# EAGLE schematic obc (EAGLE 9.4.2), part 2 of 2
## Sheet 7 of 8: Sensors
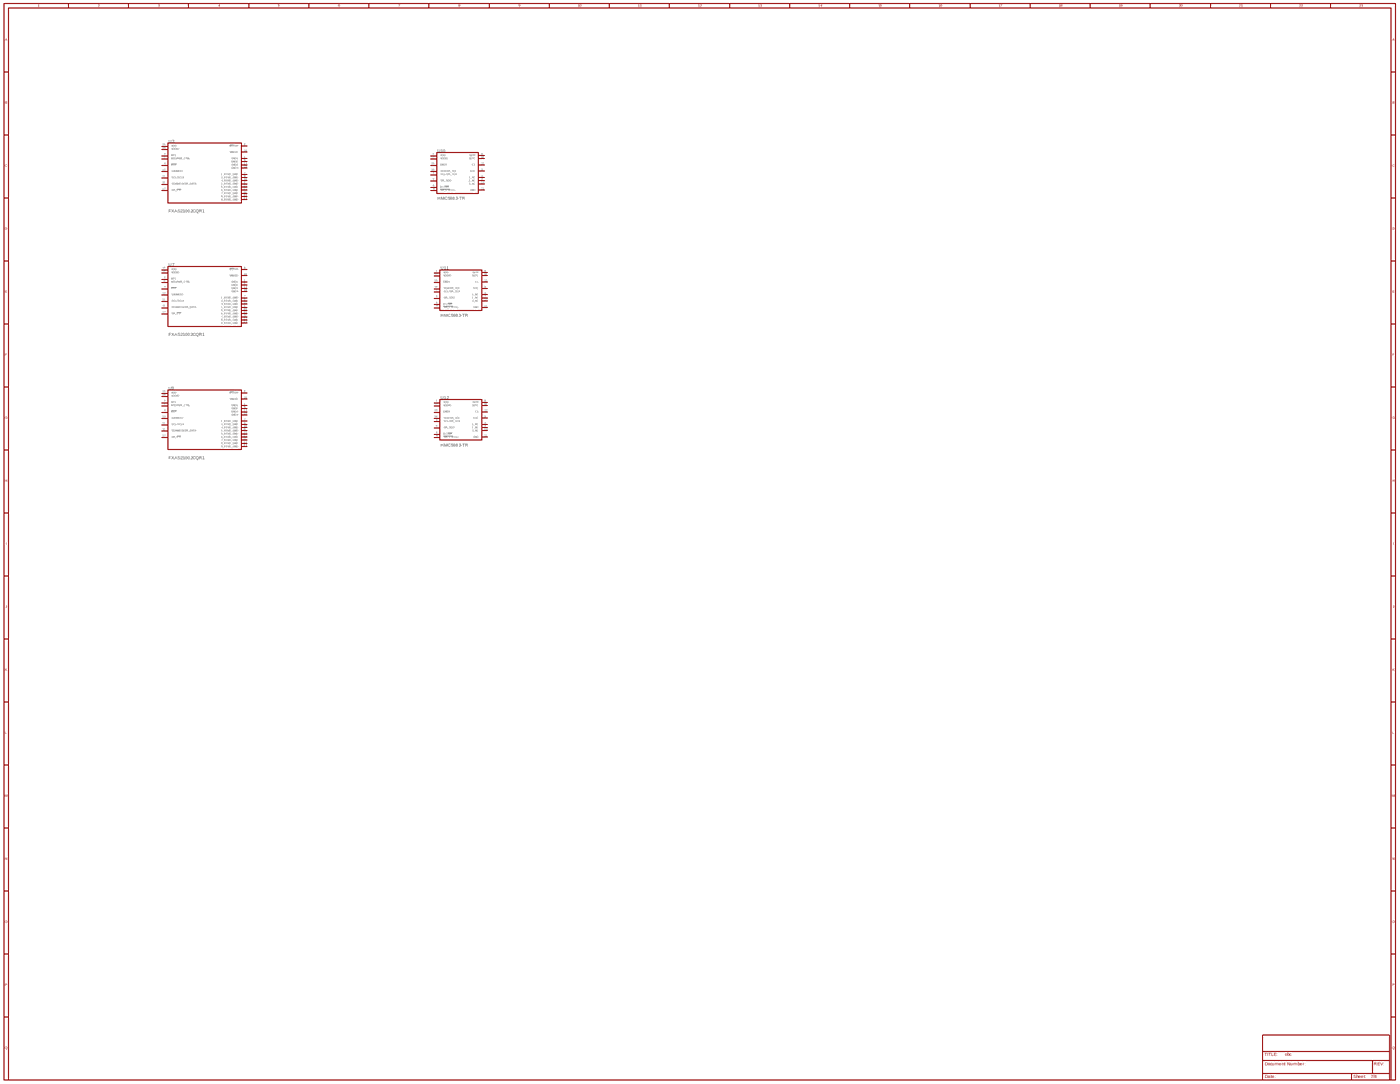
[diagram p19: schematic, sheet 7, overview]
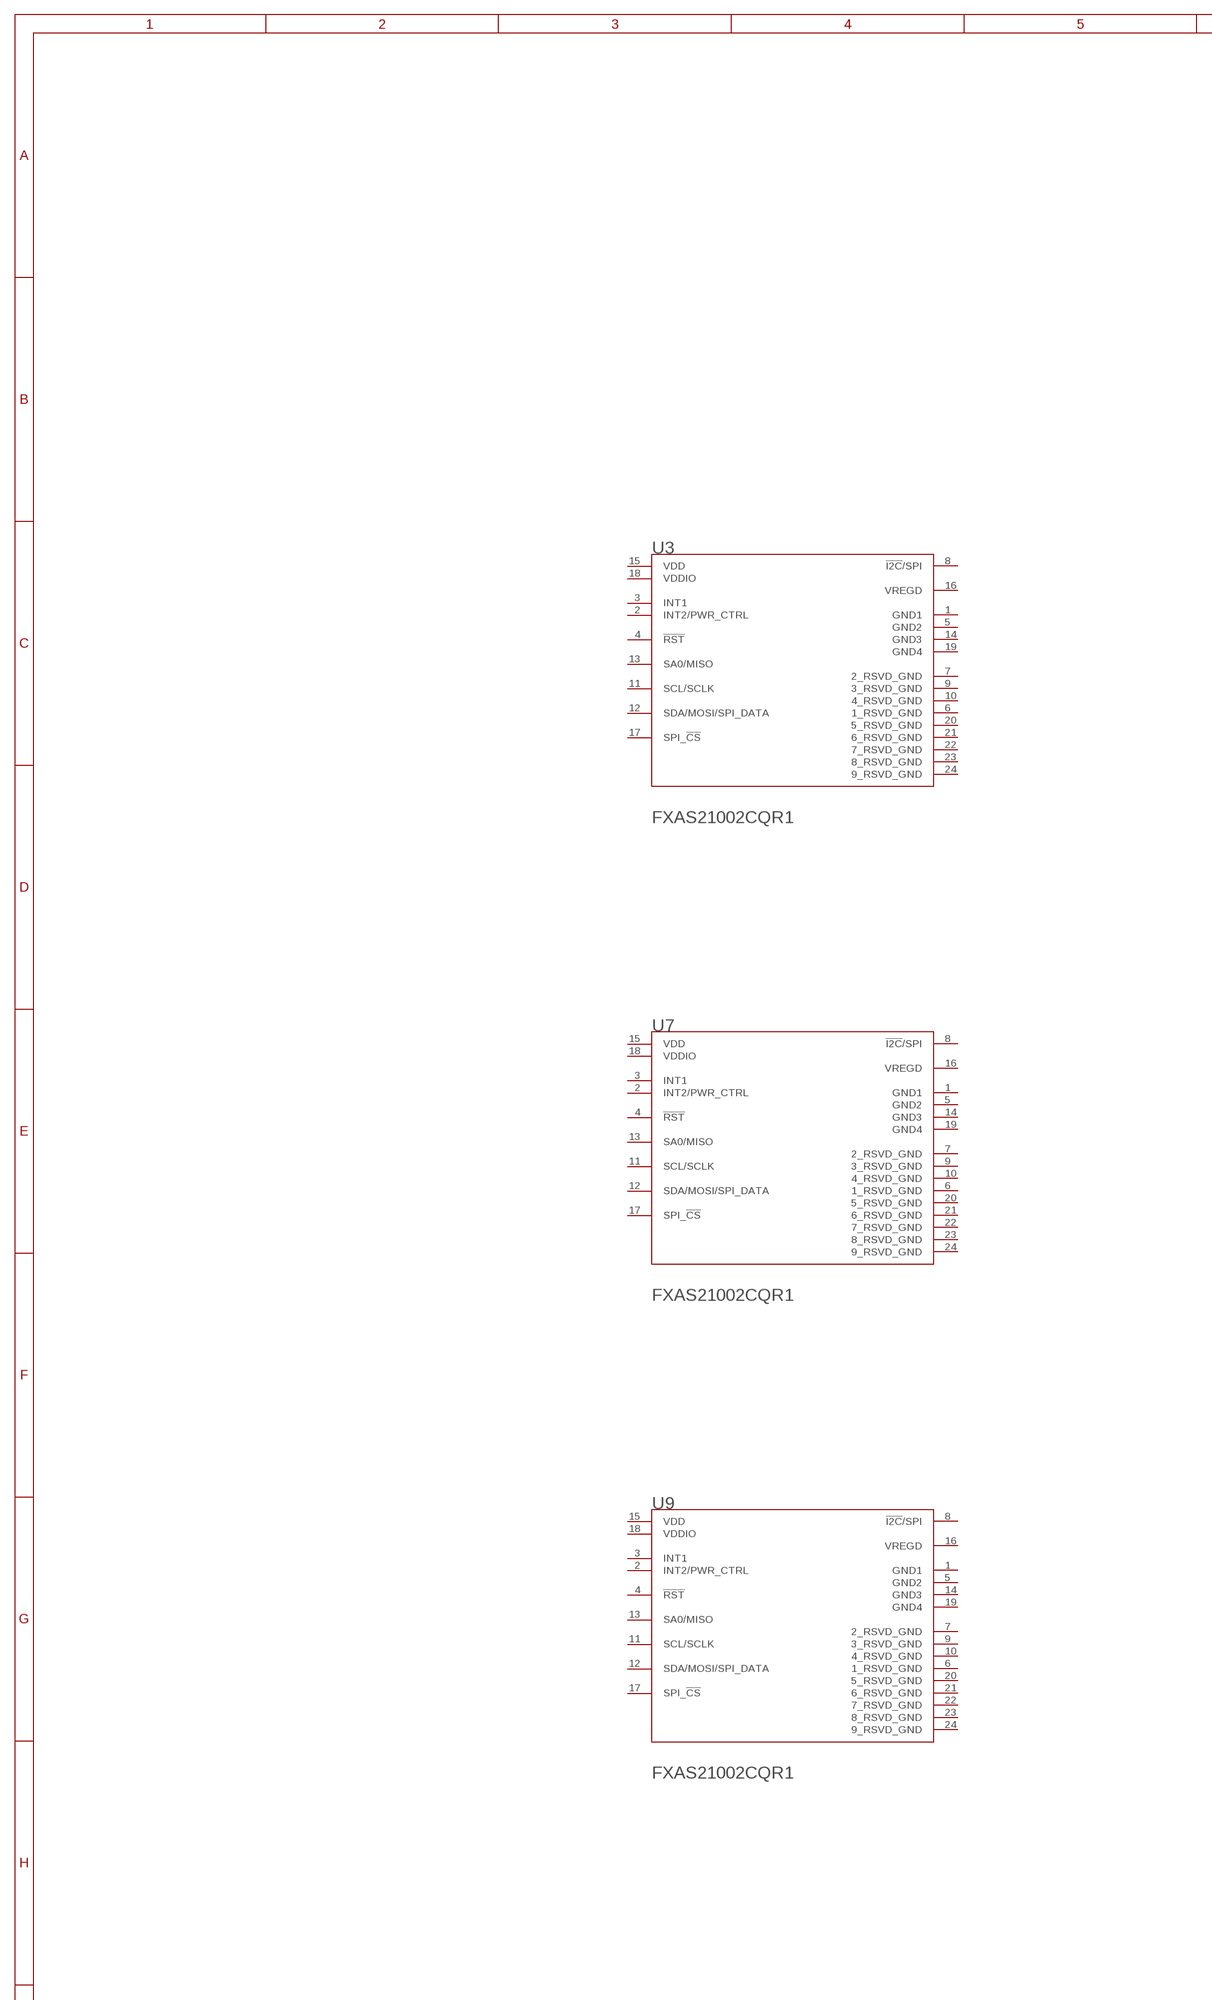
[diagram p20: schematic, sheet 7, part 1 of 6]
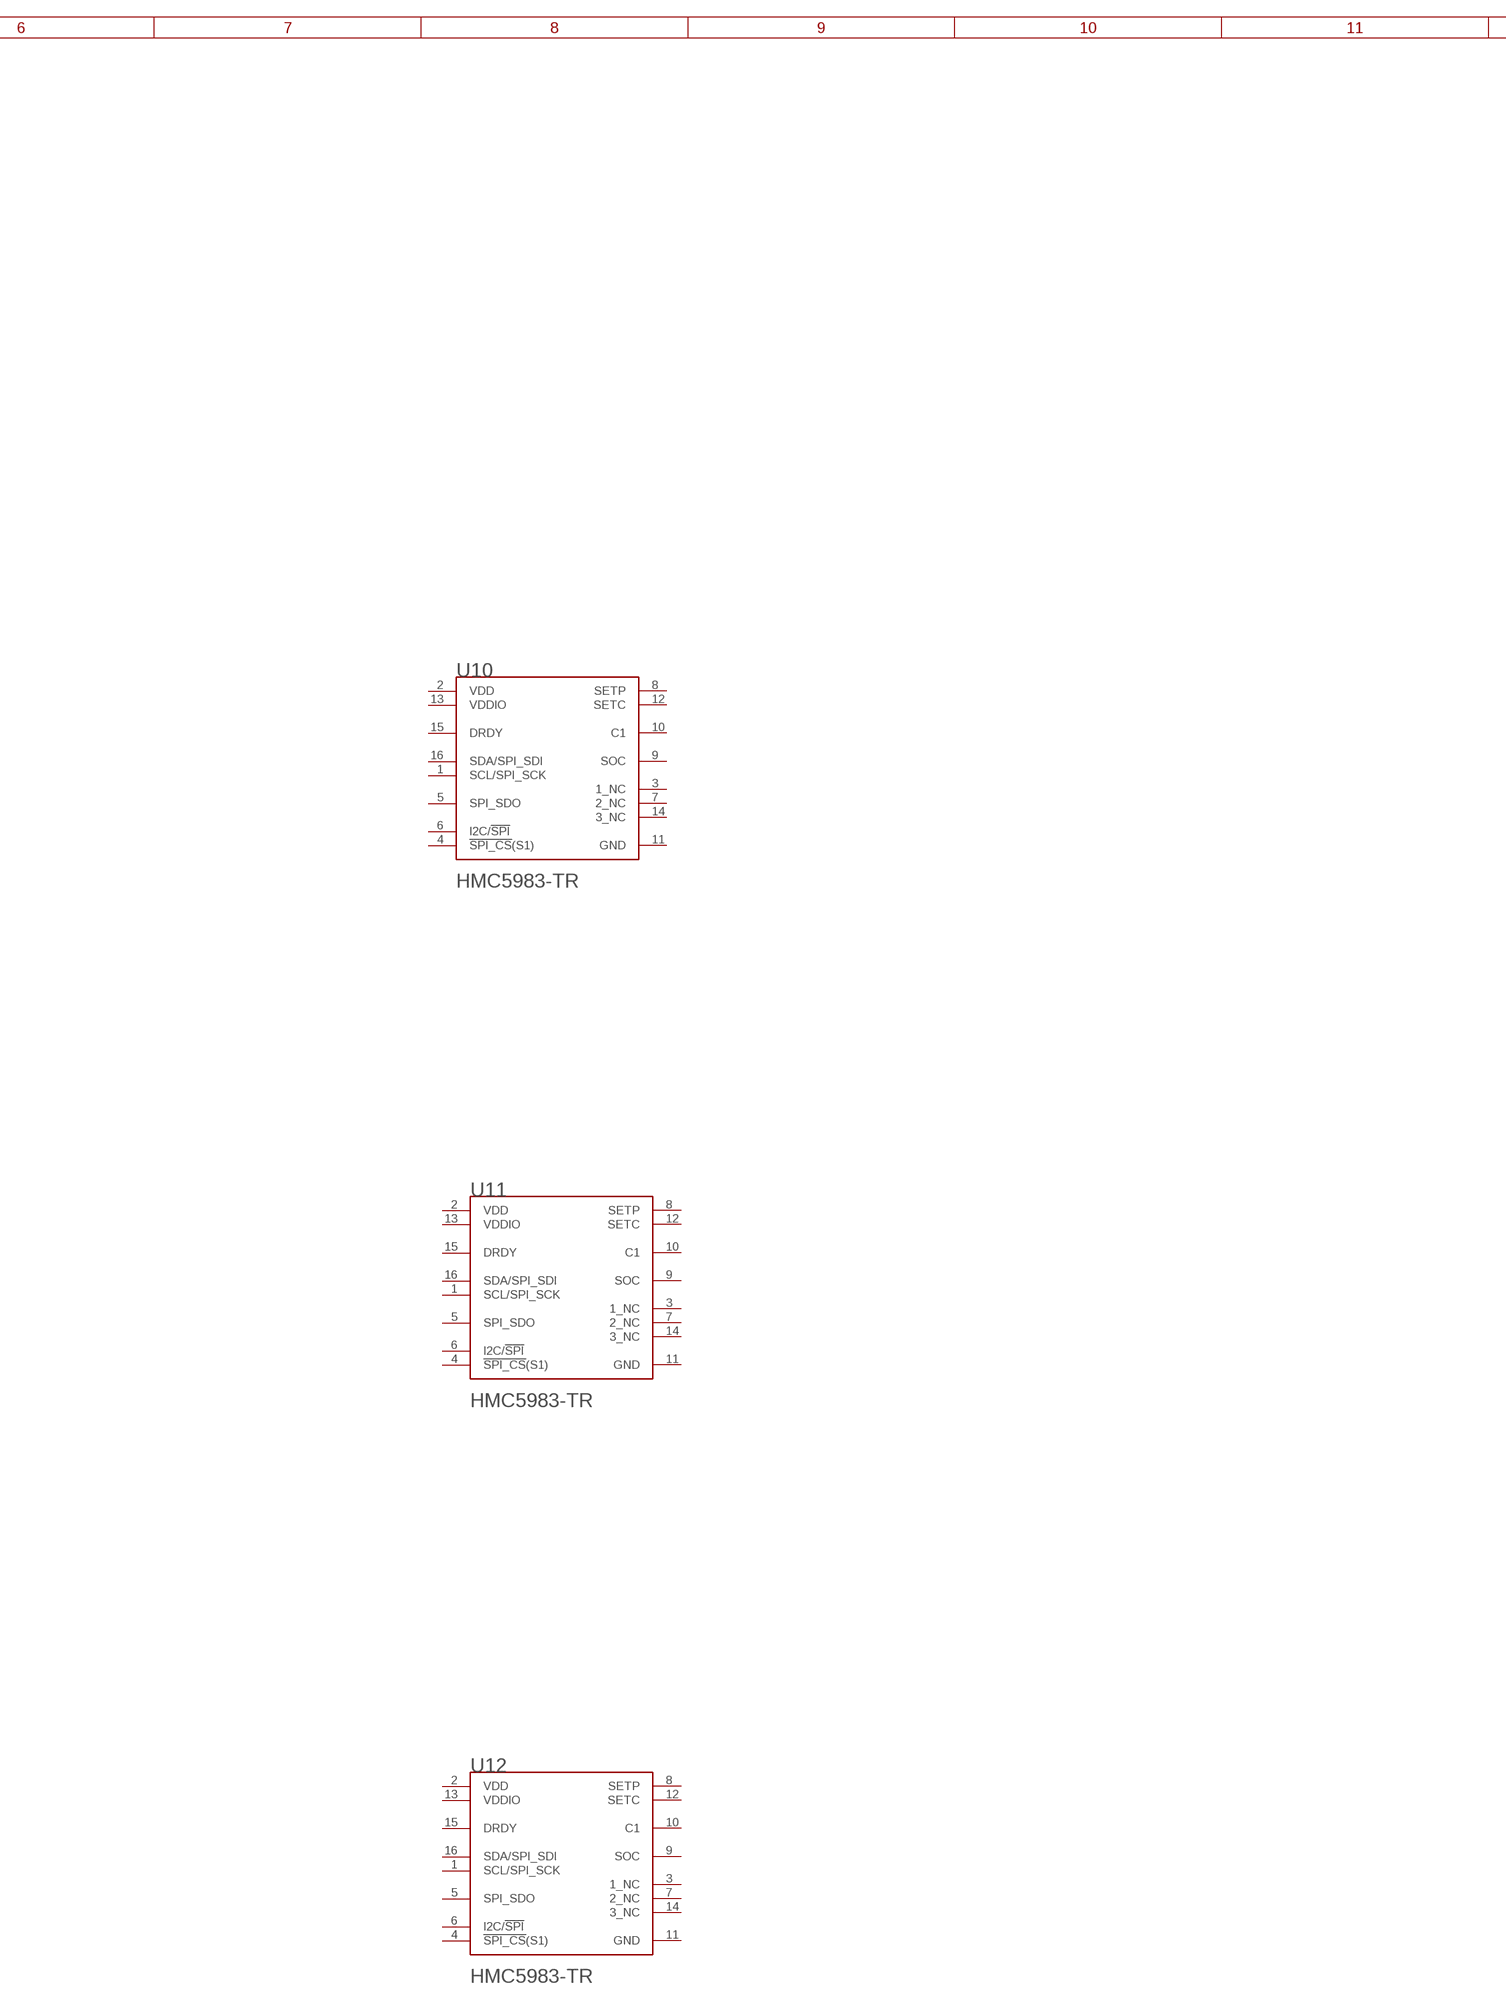
[diagram p21: schematic, sheet 7, part 2 of 6]
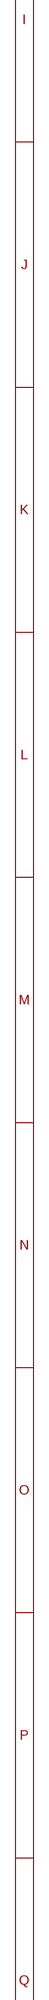
[diagram p22: schematic, sheet 7, part 3 of 6]
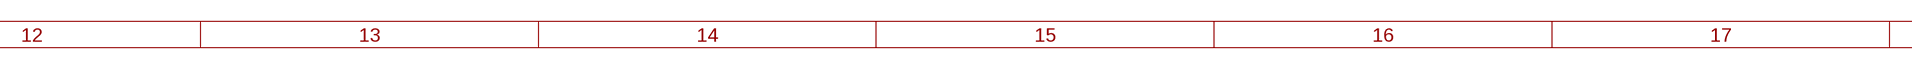
[diagram p23: schematic, sheet 7, part 4 of 6]
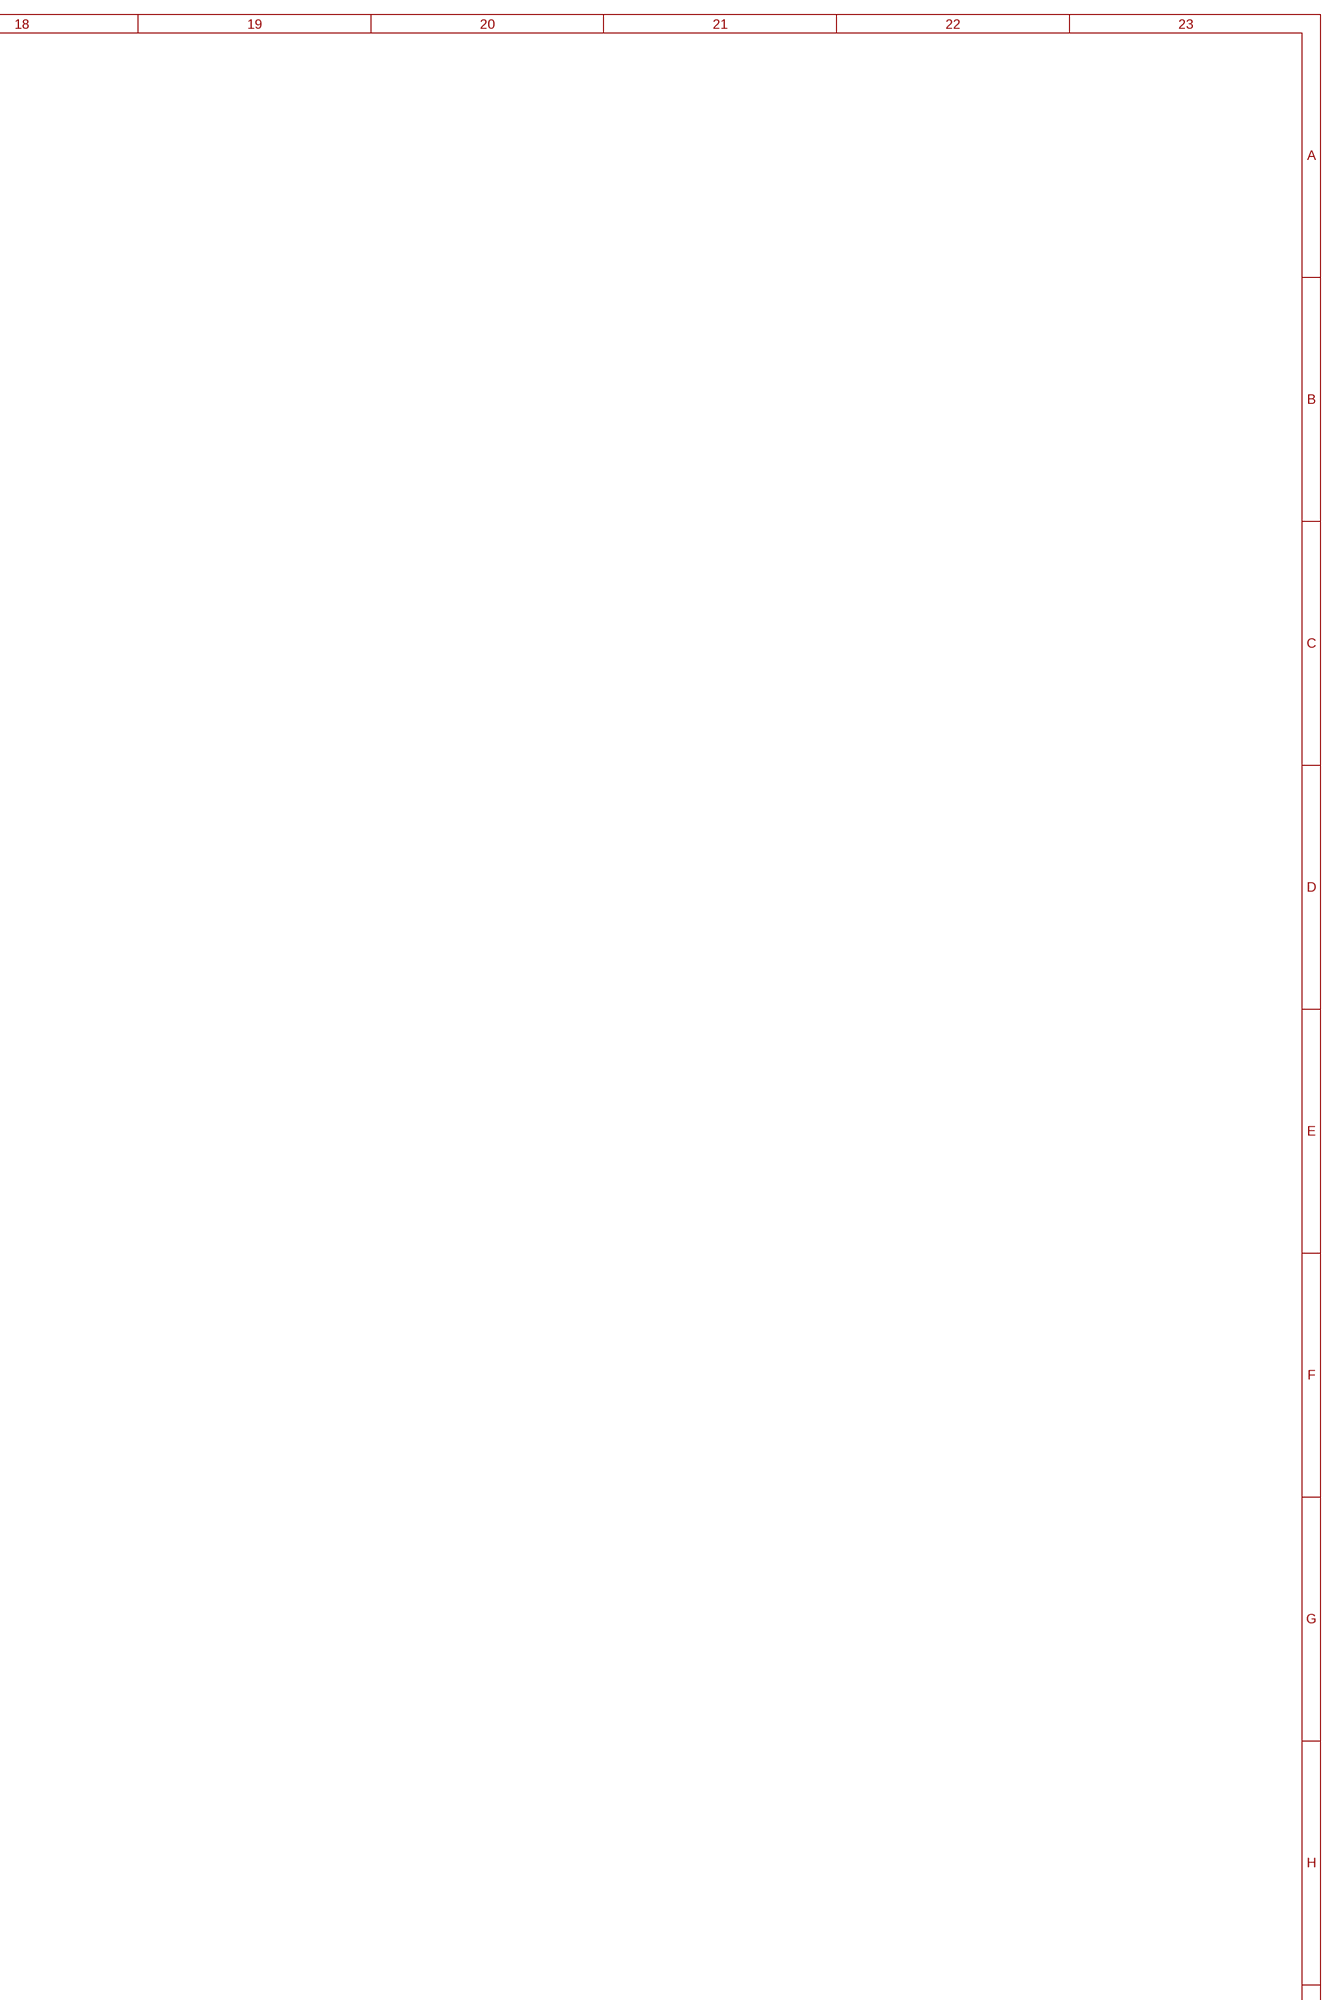
[diagram p24: schematic, sheet 7, part 5 of 6]
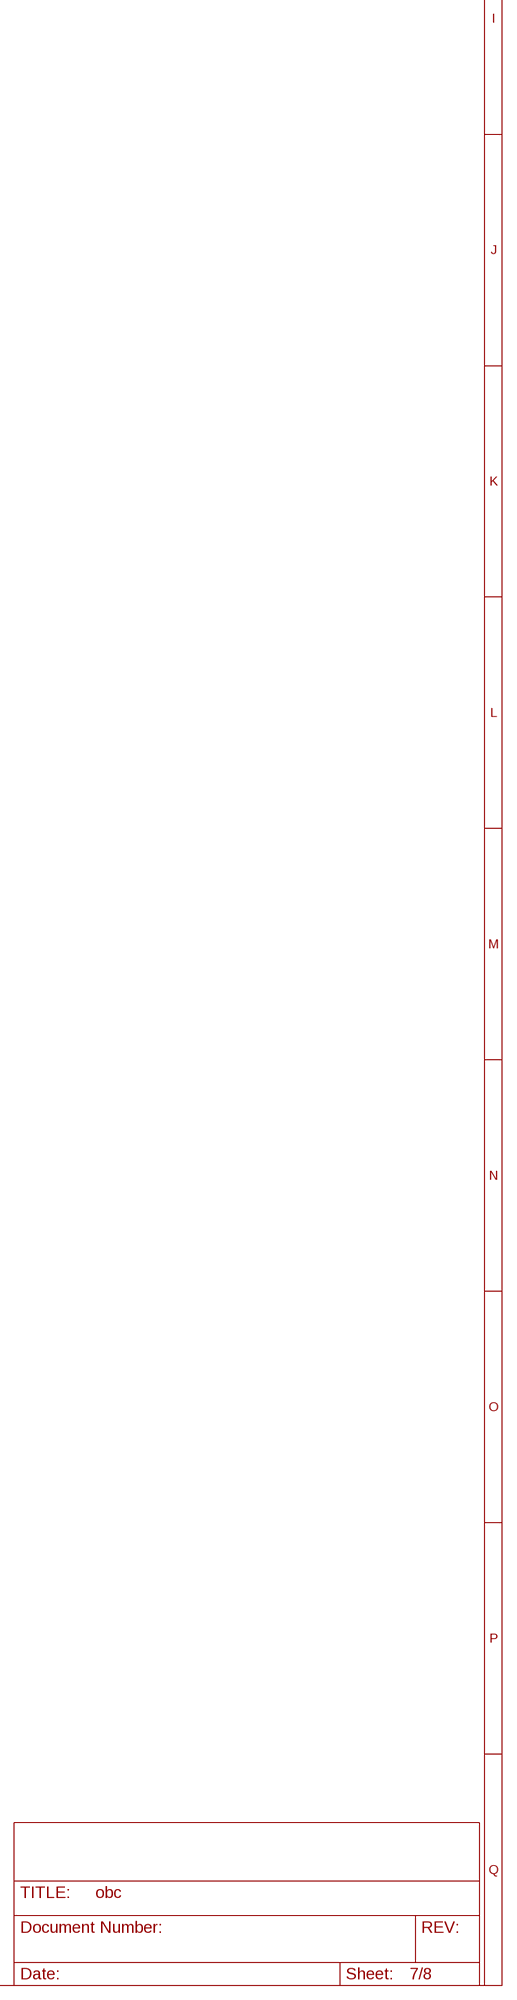
[diagram p25: schematic, sheet 7, part 6 of 6]

### Parts
U3  NXP_FXAS21002CQR1NXP_FXAS21002CQR1_0_0  [NXP_FXAS21002CQR1_0]
U7  NXP_FXAS21002CQR1NXP_FXAS21002CQR1_0_0  [NXP_FXAS21002CQR1_0]
U9  NXP_FXAS21002CQR1NXP_FXAS21002CQR1_0_0  [NXP_FXAS21002CQR1_0]
U10  HONEYWELL_HMC5983-TRHONEYWELL_HMC5983-TR_0_0  [HONEYWELL_HMC5983-TR_0]
U11  HONEYWELL_HMC5983-TRHONEYWELL_HMC5983-TR_0_0  [HONEYWELL_HMC5983-TR_0]
U12  HONEYWELL_HMC5983-TRHONEYWELL_HMC5983-TR_0_0  [HONEYWELL_HMC5983-TR_0]
Unconnected: U3.2(INT2/PWR_CTRL) U3.3(INT1) U3.4(!RST!) U3.8(!I2C!/SPI) U3.11(SCL/SCLK) U3.12(SDA/MOSI/SPI_DATA) U3.13(SA0/MISO) U3.16(VREGD) U3.17(SPI_!CS!) U7.2(INT2/PWR_CTRL) U7.3(INT1) U7.4(!RST!) U7.8(!I2C!/SPI) U7.11(SCL/SCLK) U7.12(SDA/MOSI/SPI_DATA) U7.13(SA0/MISO) U7.16(VREGD) U7.17(SPI_!CS!) U9.2(INT2/PWR_CTRL) U9.3(INT1) U9.4(!RST!) U9.8(!I2C!/SPI) U9.11(SCL/SCLK) U9.12(SDA/MOSI/SPI_DATA) U9.13(SA0/MISO) U9.16(VREGD) U9.17(SPI_!CS!) U10.1(SCL/SPI_SCK) U10.2(VDD) U10.3(1_NC) U10.4(!SPI_CS!(S1)) U10.5(SPI_SDO) U10.6(I2C/!SPI!) U10.7(2_NC) U10.8(SETP) U10.9(SOC) U10.10(C1) U10.11(GND) U10.12(SETC) U10.13(VDDIO) U10.14(3_NC) U10.15(DRDY) U10.16(SDA/SPI_SDI) U11.1(SCL/SPI_SCK) U11.2(VDD) U11.3(1_NC) U11.4(!SPI_CS!(S1)) U11.5(SPI_SDO) U11.6(I2C/!SPI!) U11.7(2_NC) U11.8(SETP) U11.9(SOC) U11.10(C1) U11.11(GND) U11.12(SETC) U11.13(VDDIO) U11.14(3_NC) U11.15(DRDY) U11.16(SDA/SPI_SDI) U12.1(SCL/SPI_SCK) U12.2(VDD) U12.3(1_NC) U12.4(!SPI_CS!(S1)) U12.5(SPI_SDO) U12.6(I2C/!SPI!) U12.7(2_NC) U12.8(SETP) U12.9(SOC) U12.10(C1) U12.11(GND) U12.12(SETC) U12.13(VDDIO) U12.14(3_NC) U12.15(DRDY) U12.16(SDA/SPI_SDI)

## Sheet 8 of 8: Molex Connectors
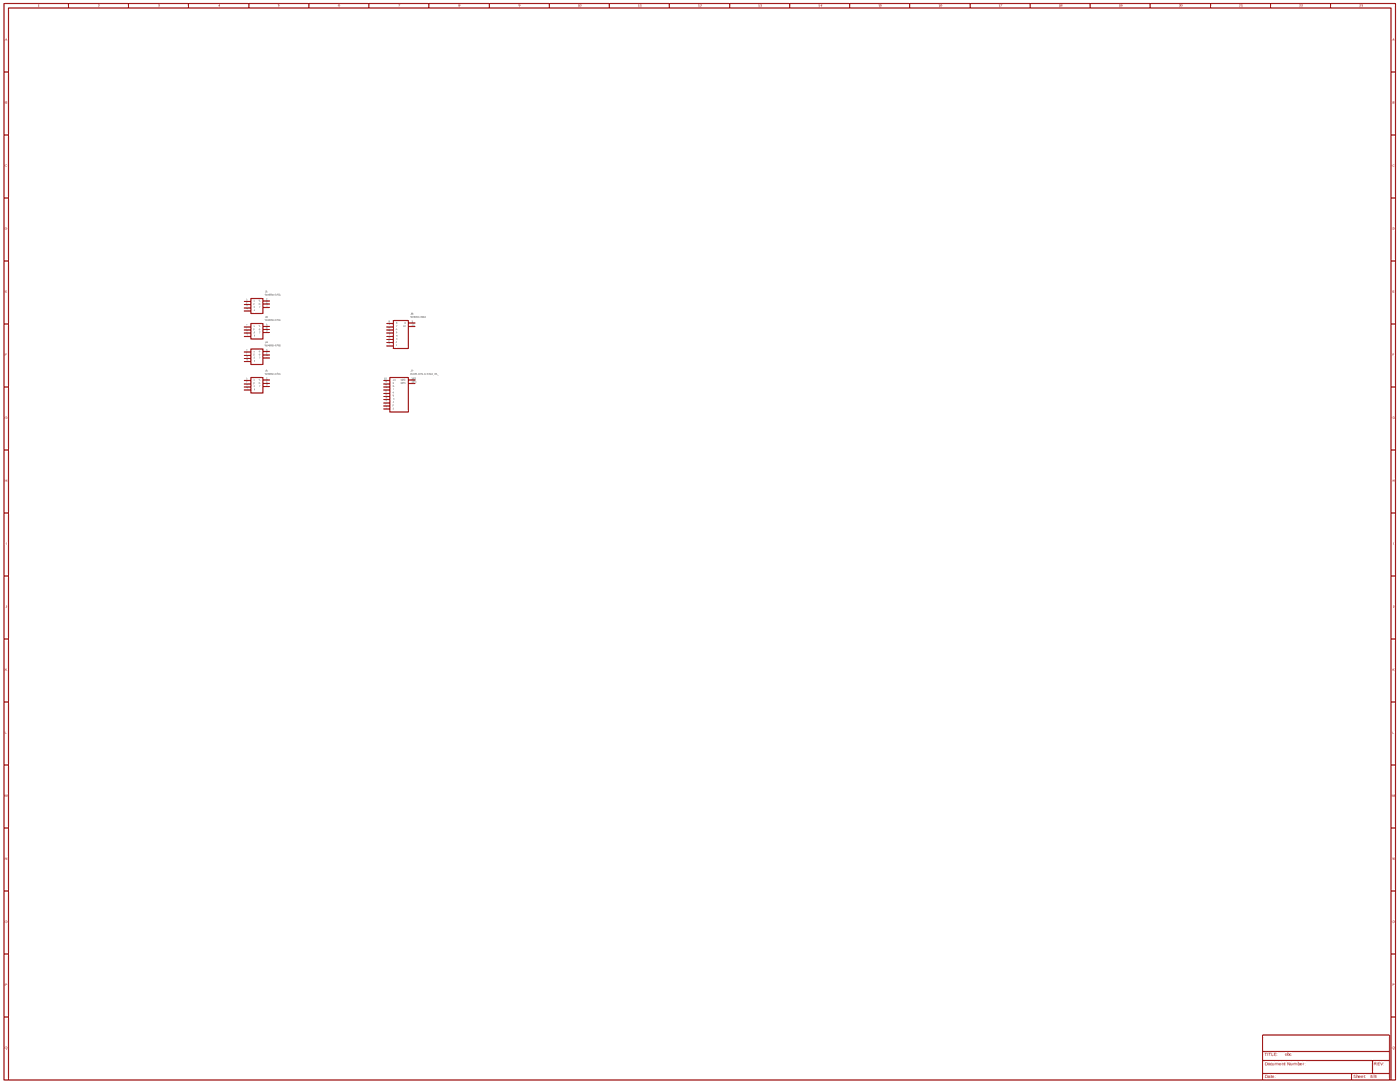
[diagram p26: schematic, sheet 8, overview]
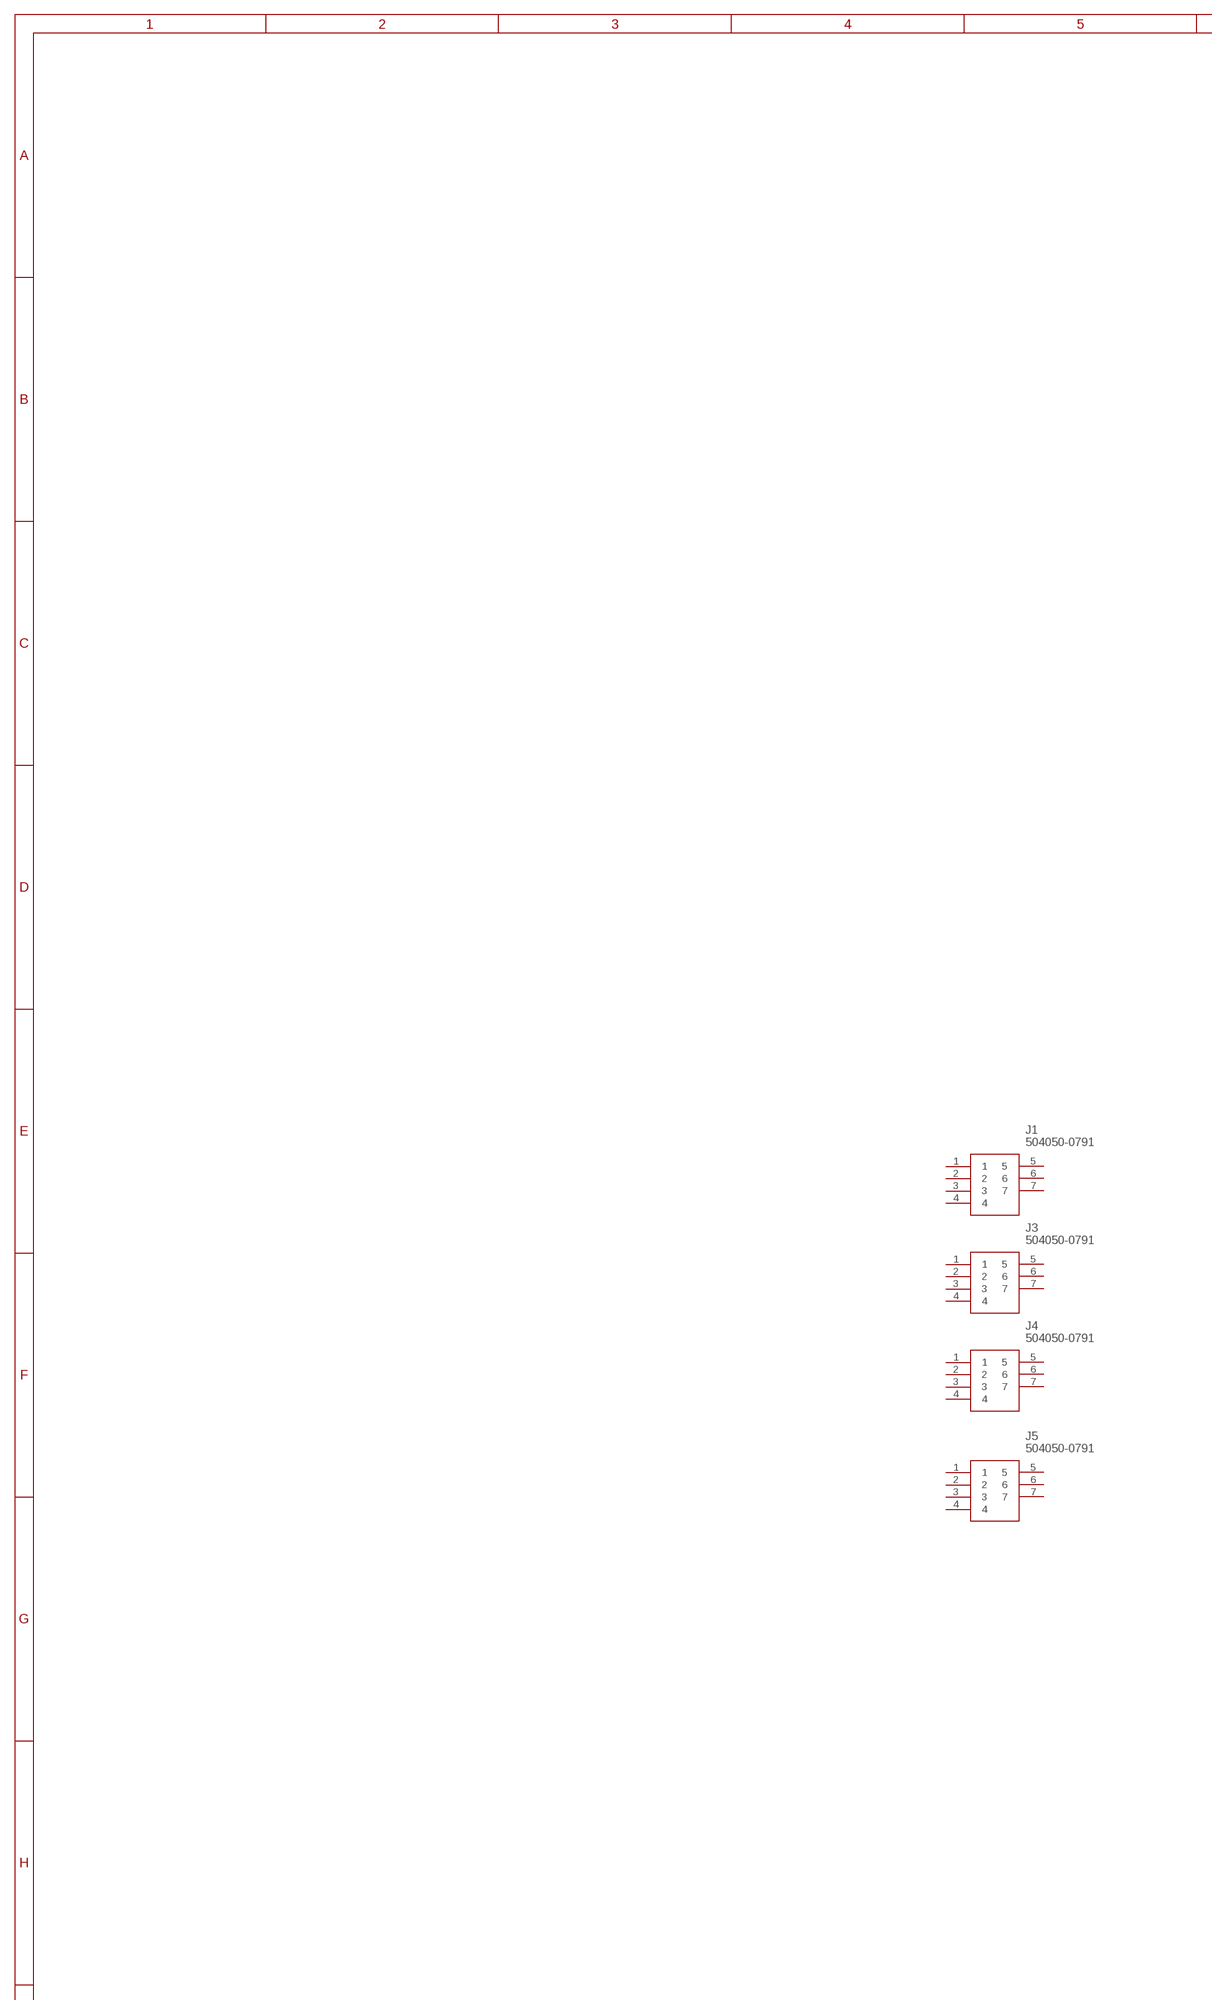
[diagram p27: schematic, sheet 8, part 1 of 6]
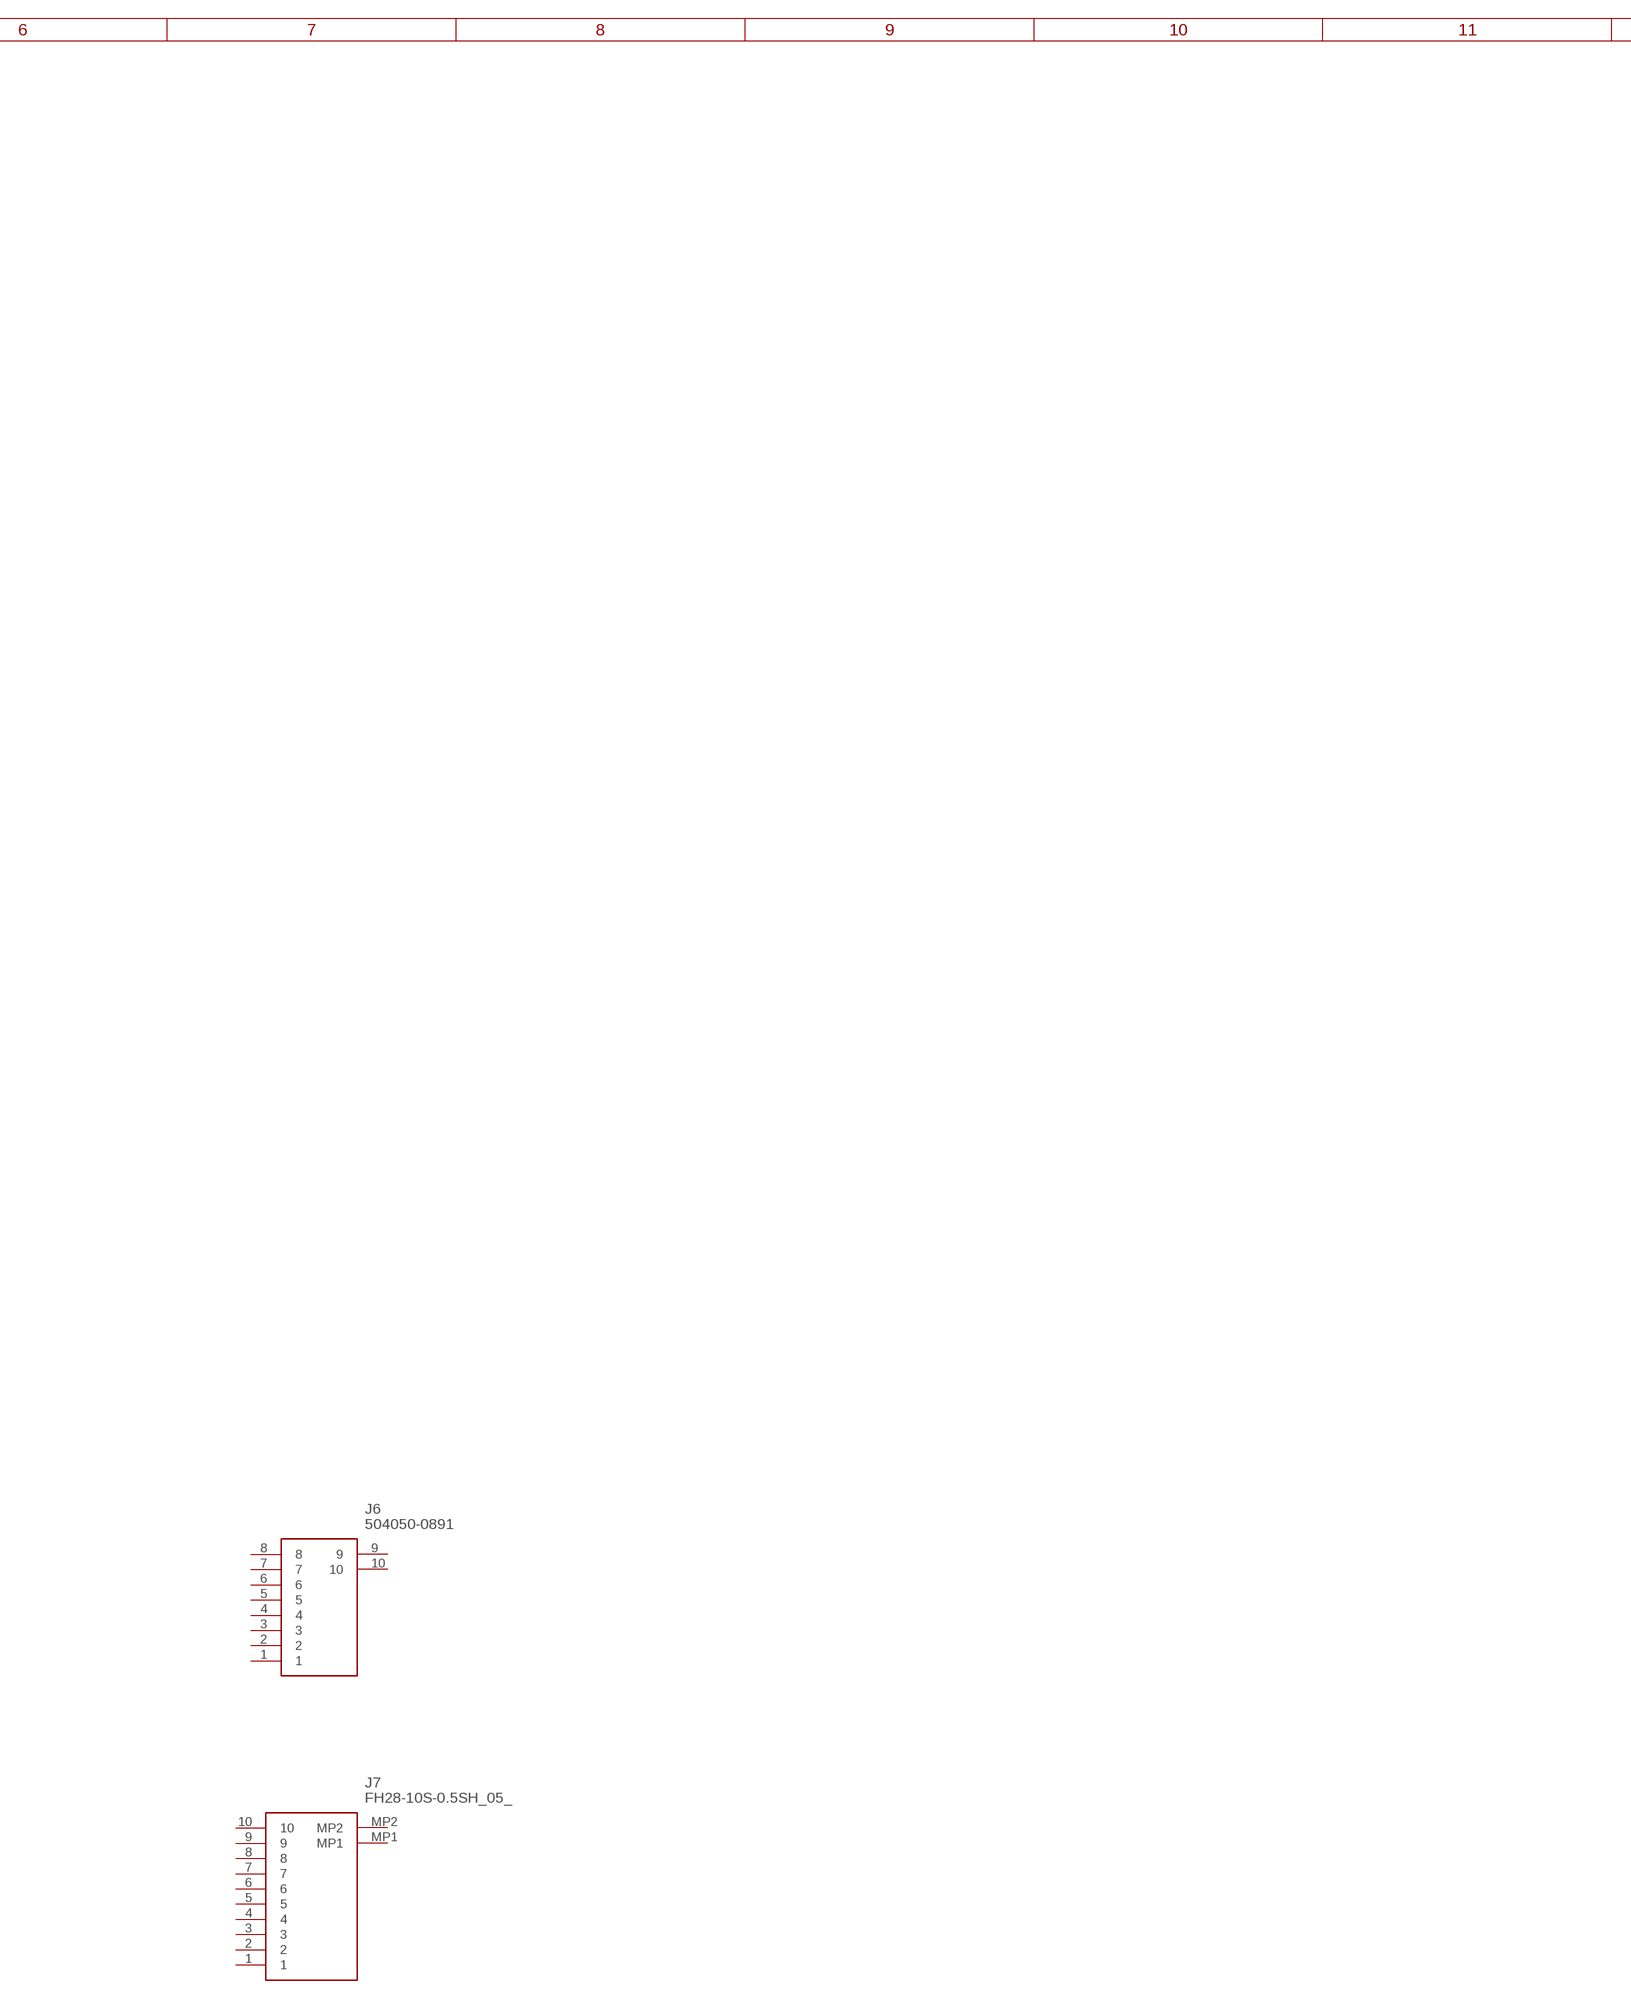
[diagram p28: schematic, sheet 8, part 2 of 6]
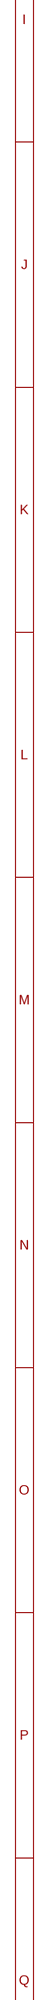
[diagram p29: schematic, sheet 8, part 3 of 6]
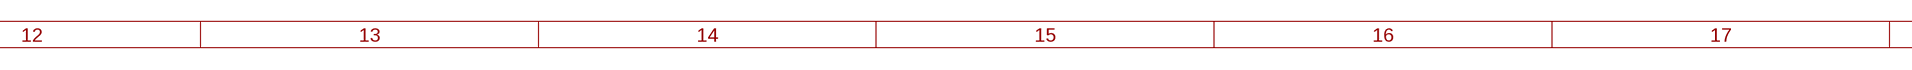
[diagram p30: schematic, sheet 8, part 4 of 6]
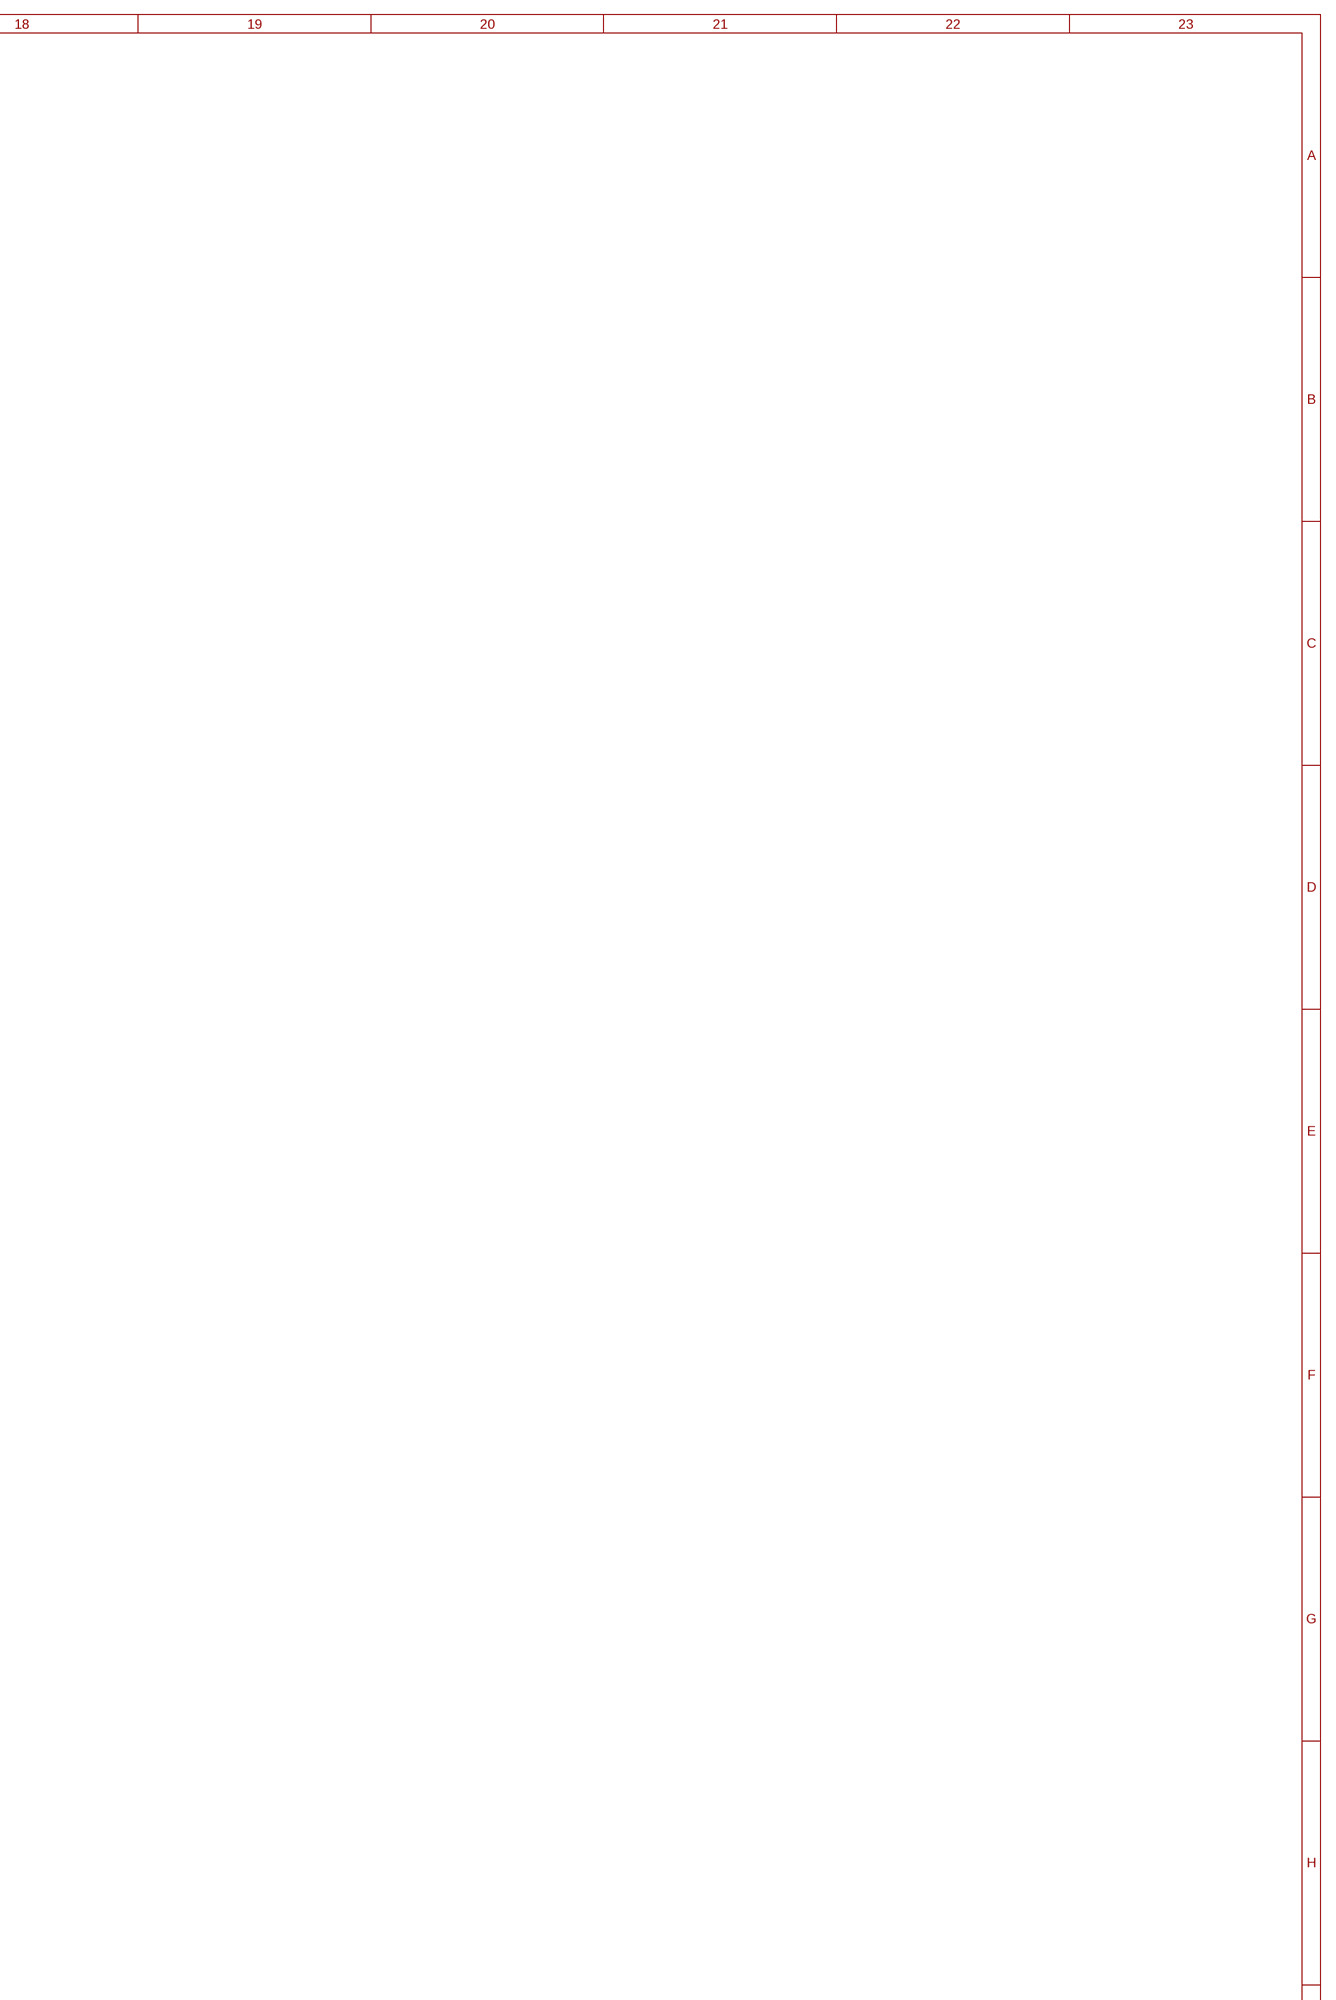
[diagram p31: schematic, sheet 8, part 5 of 6]
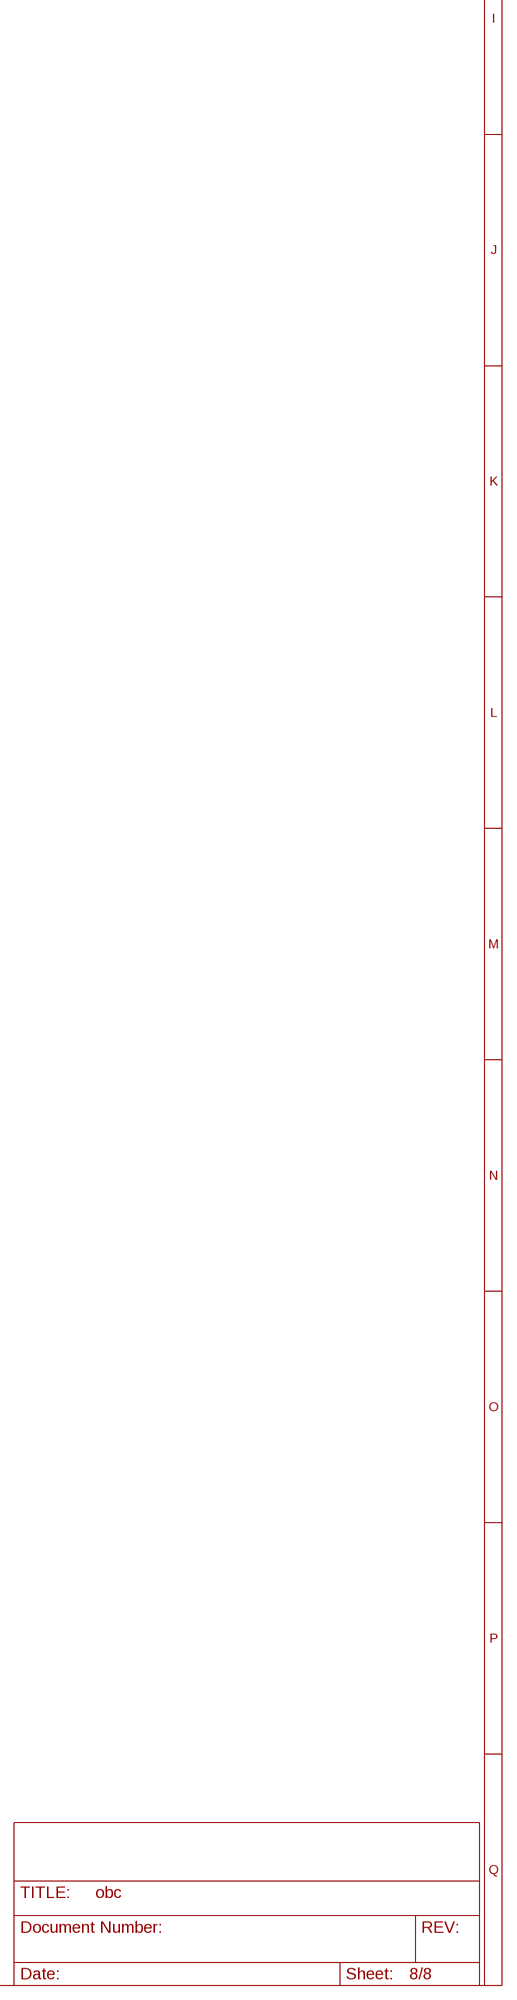
[diagram p32: schematic, sheet 8, part 6 of 6]

### Parts
J1  504050-0791  [504050-0791]
J3  504050-0791  [504050-0791]
J4  504050-0791  [504050-0791]
J5  504050-0791  [504050-0791]
J6  504050-0891  [5040500891]
J7  FH28-10S-0.5SH_05_  [FH2810S05SH05]
Unconnected: J1.1 J1.2 J1.3 J1.4 J1.5 J1.6 J1.7 J3.1 J3.2 J3.3 J3.4 J3.5 J3.6 J3.7 J4.1 J4.2 J4.3 J4.4 J4.5 J4.6 J4.7 J5.1 J5.2 J5.3 J5.4 J5.5 J5.6 J5.7 J6.1 J6.2 J6.3 J6.4 J6.5 J6.6 J6.7 J6.8 J6.9 J6.10 J7.1 J7.2 J7.3 J7.4 J7.5 J7.6 J7.7 J7.8 J7.9 J7.10 J7.MP1 J7.MP2

## Power pins joined to a net without a drawn wire
1_RSVD_GND: U3.6(1_RSVD_GND) U7.6(1_RSVD_GND) U9.6(1_RSVD_GND)
2_RSVD_GND: U3.7(2_RSVD_GND) U7.7(2_RSVD_GND) U9.7(2_RSVD_GND)
3_RSVD_GND: U3.9(3_RSVD_GND) U7.9(3_RSVD_GND) U9.9(3_RSVD_GND)
4_RSVD_GND: U3.10(4_RSVD_GND) U7.10(4_RSVD_GND) U9.10(4_RSVD_GND)
5_RSVD_GND: U3.20(5_RSVD_GND) U7.20(5_RSVD_GND) U9.20(5_RSVD_GND)
6_RSVD_GND: U3.21(6_RSVD_GND) U7.21(6_RSVD_GND) U9.21(6_RSVD_GND)
7_RSVD_GND: U3.22(7_RSVD_GND) U7.22(7_RSVD_GND) U9.22(7_RSVD_GND)
8_RSVD_GND: U3.23(8_RSVD_GND) U7.23(8_RSVD_GND) U9.23(8_RSVD_GND)
9_RSVD_GND: U3.24(9_RSVD_GND) U7.24(9_RSVD_GND) U9.24(9_RSVD_GND)
GND1: U3.1(GND1) U7.1(GND1) U9.1(GND1)
GND2: U3.5(GND2) U7.5(GND2) U9.5(GND2)
GND3: U3.14(GND3) U7.14(GND3) U9.14(GND3)
GND4: U3.19(GND4) U7.19(GND4) U9.19(GND4)
NVCC_SD0: U1.J6(NVCC_SD0)
VDD: U3.15(VDD) U7.15(VDD) U9.15(VDD)
VDDIO: U3.18(VDDIO) U7.18(VDDIO) U9.18(VDDIO)

## Library data of the parts
C1-C56 C63-C71 C76-C82 = rcl:C-EU: CAPACITOR, European symbol; SPICEPREFIX: C
D1 D3 = diode:SCHOTTKY-DIODE: Schottky Diode
D4 D5 D11 = Kingbright - KPT-1608SGC:KINGBRIGHT_KPT-1608SGC: LED, Low Power, Green, SMD, 20 mA, 2.2 V, 568 nm; CENTROID_NOT_SPECIFIED: No; COLOUR: Green; DATASHEET: http://www.kingbright.com/attachments/file/psearch/000/00/00/KPT-1608SGC(Ver.29B).pdf; DEVICE_CLASS_L1: Optoelectronics; DEVICE_CLASS_L2: LEDs; DEVICE_CLASS_L3: unset; FORWARD_CURRENT: 25mA; FORWARD_VOLTAGE: 2.2V; HEIGHT: 0.85mm; LEAD_FREE: yes; LED_ORIENTATION: Top View; LUMINOUS_INTENSITY: 12mcd; MAX_JUNCTION_TEMP: +110°C; MF: Kingbright; MFG_PACKAGE_IDENT: KPT-1608SGC; MFG_PACKAGE_IDENT_DATE: 0; MFG_PACKAGE_IDENT_REV: 0; MPN: KPT-1608SGC; PACKAGE: 0603; POWER_DISSIPATION: 62.5mW; PREFIX: D; REVERSE_VOLTAGE: 5V; ROHS: yes; TEMPERATURE_RANGE_HIGH: +85°C; TEMPERATURE_RANGE_LOW: -40°C; VERIFICATION_VERSION: 0.0.0.1; VIEWING_ANGLE: 150°; WAVELENGTH: 568nm
D8-D10 = 0402ESDA-MLP1:0402ESDA-MLP1: ESD Suppressors / TVS Diodes PolySurg 0402 35V .05pF Source: Datasheet <https://componentsearchengine.com/Datasheets/1/0402ESDA-MLP1.pdf>; DESCRIPTION: ESD Suppressors / TVS Diodes PolySurg 0402 35V .05pF; HEIGHT: 0.436mm; MANUFACTURER_NAME: Eaton; MANUFACTURER_PART_NUMBER: 0402ESDA-MLP1; MOUSER_PART_NUMBER: 504-0402ESDA-MLP1; MOUSER_PRICE-STOCK: https://www.mouser.com/Search/Refine.aspx?Keyword=504-0402ESDA-MLP1
FB1 FB2 = MPZ1608S331A:MPZ1608S331A: Ferrite Beads NEW MFG PN 810-MPZ1608S331ATA00 Source: Datasheet <https://componentsearchengine.com/Datasheets/1/MPZ1608S331A.pdf>; DESCRIPTION: Ferrite Beads NEW MFG PN 810-MPZ1608S331ATA00; HEIGHT: 0.95mm; MANUFACTURER_NAME: TDK; MANUFACTURER_PART_NUMBER: MPZ1608S331A; MOUSER_PART_NUMBER: 810-MPZ1608S331A; MOUSER_PRICE-STOCK: https://www.mouser.com/Search/Refine.aspx?Keyword=810-MPZ1608S331A
IC1 = SDRAM_and_HyperFlash:IS42S16160J-6BLI: DRAM 256M, 3.3V, SDRAM, 16Mx16, 166Mhz, 54 ball BGA (8mmx8mm) RoHS, IT Source: Datasheet <https://componentsearchengine.com/Datasheets/1/IS42S16160J-6BLI.pdf>; DESCRIPTION: DRAM 256M, 3.3V, SDRAM, 16Mx16, 166Mhz, 54 ball BGA (8mmx8mm) RoHS, IT; HEIGHT: 1.2mm; MANUFACTURER_NAME: Integrated Silicon Solution Inc.; MANUFACTURER_PART_NUMBER: IS42S16160J-6BLI; MOUSER_PART_NUMBER: 870-42S16160J6BLI; MOUSER_PRICE-STOCK: https://www.mouser.com/Search/Refine.aspx?Keyword=870-42S16160J6BLI
IC2 = SDRAM_and_HyperFlash:S26KS512SDPBHI020: 1.8V 512MBIT, HYPERFLASH, 166M Source: Datasheet <https://componentsearchengine.com/Datasheets/1/S26KS512SDPBHI020.pdf>; DESCRIPTION: 1.8V 512MBIT, HYPERFLASH, 166M; HEIGHT: 1mm; MANUFACTURER_NAME: Cypress Semiconductor; MANUFACTURER_PART_NUMBER: S26KS512SDPBHI020; MOUSER_PART_NUMBER: 727-26KS512SDPBHI020; MOUSER_PRICE-STOCK: https://www.mouser.com/Search/Refine.aspx?Keyword=727-26KS512SDPBHI020
IC3 = 74LVC2T45GS_115:74LVC2T45GS,115: 74LVC2T45; 74LVCH2T45 - Dual supply translating transceiver; 3-state@en-us Source: Datasheet <https://componentsearchengine.com/Datasheets/1/74LVC2T45GS,115.pdf>; DESCRIPTION: 74LVC2T45; 74LVCH2T45 - Dual supply translating transceiver; 3-state@en-us; HEIGHT: 0.35mm; MANUFACTURER_NAME: Nexperia; MANUFACTURER_PART_NUMBER: 74LVC2T45GS,115; MOUSER_PART_NUMBER: 771-74LVC2T45GS115; MOUSER_PRICE-STOCK: https://www.mouser.com/Search/Refine.aspx?Keyword=771-74LVC2T45GS115
IC4 IC7 IC8 = 74LVCH1T45GS_132:74LVCH1T45GS,132: 74LVC1T45; 74LVCH1T45 - Dual supply translating transceiver; 3-state@en-us Source: Datasheet <https://componentsearchengine.com/Datasheets/1/74LVCH1T45GS,132.pdf>; DESCRIPTION: 74LVC1T45; 74LVCH1T45 - Dual supply translating transceiver; 3-state@en-us; HEIGHT: 0.35mm; MANUFACTURER_NAME: Nexperia; MANUFACTURER_PART_NUMBER: 74LVCH1T45GS,132; MOUSER_PART_NUMBER: 771-74LVCH1T45GS132; MOUSER_PRICE-STOCK: https://www.mouser.com/Search/Refine.aspx?Keyword=771-74LVCH1T45GS132
J1 J3-J5 = 504050-0791:504050-0791: Molex 504050 Series, 1.5mm Pitch 7 Way 1 Row Right Angle PCB Header, SMT Termination, 3A Source: Datasheet <https://componentsearchengine.com/Datasheets/1/504050-0791.pdf>; DESCRIPTION: Molex 504050 Series, 1.5mm Pitch 7 Way 1 Row Right Angle PCB Header, SMT Termination, 3A; HEIGHT: mm; MANUFACTURER_NAME: Molex; MANUFACTURER_PART_NUMBER: 504050-0791; MOUSER_PART_NUMBER: 538-504050-0791; MOUSER_PRICE-STOCK: https://www.mouser.com/Search/Refine.aspx?Keyword=538-504050-0791
J2 = DX4R205JJAR1800:DX4R205JJAR1800: CONN RCPT MICRO USB 2.0 AB; DESCRIPTION: DX4 series, receptacle, on-board, right-angle standard mount, surface mount; DIGI-KEY_PART_NUMBER: 670-2677-1-ND; DIGI-KEY_PURCHASE_URL: https://www.digikey.com/product-detail/en/jae-electronics/DX4R205JJAR1800/670-2677-1-ND/3903237?utm_source=snapeda&utm_medium=aggregator&utm_campaign=symbol; MF: JAE Electronics; MP: DX4R205JJAR1800; PACKAGE: None
J6 = 504050-0891:504050-0891: MOLEX - 504050-0891 - CONNECTOR, RECEPTACLE, 8POS, 1ROW, 1.5MM Source: Datasheet <https://componentsearchengine.com/Datasheets/1/504050-0891.pdf>; DESCRIPTION: MOLEX - 504050-0891 - CONNECTOR, RECEPTACLE, 8POS, 1ROW, 1.5MM; HEIGHT: 2mm; MANUFACTURER_NAME: Molex; MANUFACTURER_PART_NUMBER: 504050-0891; MOUSER_PART_NUMBER: 538-504050-0891; MOUSER_PRICE-STOCK: https://www.mouser.com/Search/Refine.aspx?Keyword=538-504050-0891
J7 = FH28-10S-0.5SH_05_:FH28-10S-0.5SH_05_: Hirose FH28 Series 0.5mm Pitch 10 Way 1 Row Right Angle SMT Female FPC Connector with Y, Gold Plated Contacts Source: Datasheet <https://componentsearchengine.com/Datasheets/1/FH28-10S-0.5SH(05).pdf>; DESCRIPTION: Hirose FH28 Series 0.5mm Pitch 10 Way 1 Row Right Angle SMT Female FPC Connector with Y, Gold Plated Contacts; HEIGHT: 5.4mm; MANUFACTURER_NAME: Hirose; MANUFACTURER_PART_NUMBER: FH28-10S-0.5SH(05); MOUSER_PART_NUMBER: 798-FH2810S05SH05; MOUSER_PRICE-STOCK: https://www.mouser.com/Search/Refine.aspx?Keyword=798-FH2810S05SH05
J8 J9 = ESQ-126-39-G-D:ESQ-126-39-G-D: Conn Elevated Socket SKT 52 POS 2.54mm Solder ST Thru-Hole Tube; DESCRIPTION: 52 Position Elevated Socket Connector Through Hole; DIGI-KEY_PART_NUMBER: SAM10462-ND; DIGI-KEY_PURCHASE_URL: https://www.digikey.com/product-detail/en/samtec-inc/ESQ-126-39-G-D/SAM10462-ND/3601055?utm_source=snapeda&utm_medium=aggregator&utm_campaign=symbol; MF: Samtec; MP: ESQ-126-39-G-D; PACKAGE: None
JP1 = pinhead:PINHD-2X10: PIN HEADER
L1 L2 = inductors:BLM15H: EMIFIL (R) Chip Ferrite Bead for GHz Noise Source: http://www.murata.com/ Ferrite Bead BLM15H.pdf
Q1 = crystal:FA-: MHz RANGE CRYSTAL UNIT Source: Epson Toyocom
Q3 = crystal:FC-12M: kHz RANGE CRYSTAL UNIT LOW PROFILE SMD Source: Epson Toyocom FC-12M.pdf
R1-R7 R12-R18 R20-R27 R36-R40 R43 R44 R46-R48 R50 R55-R59 R63 R106-R111 R114 R116-R131 R134 = rcl:R-EU_: RESISTOR, European symbol; SPICEPREFIX: R
R64 R65 R74-R76 R81-R100 = ngspice-simulation:R: RESISTOR
R80 = CSTCE8M00G55-R0:CSTCE8M00G55-R0: SMT ceramic resonator 8.0MHz CSTCE8M00G55-R0, Ceramic Resonator, 8MHz Fundamental 33pF, 3-Pin Cap Chip, 3.2 x 1.3 x 0.7mm Source: Datasheet <https://componentsearchengine.com/Datasheets/1/CSTCE8M00G55-R0.pdf>; DESCRIPTION: SMT ceramic resonator 8.0MHz CSTCE8M00G55-R0, Ceramic Resonator, 8MHz Fundamental 33pF, 3-Pin Cap Chip, 3.2 x 1.3 x 0.7mm; HEIGHT: mm; MANUFACTURER_NAME: Murata Electronics; MANUFACTURER_PART_NUMBER: CSTCE8M00G55-R0; MOUSER_PART_NUMBER: 81-CSTCE8M00G55-R0; MOUSER_PRICE-STOCK: https://www.mouser.com/Search/Refine.aspx?Keyword=81-CSTCE8M00G55-R0
S1 = TL3301AF260QG:TL3301AF260QG: E-SWITCH - TL3301AF260QG - SWITCH, TACTILE SPST 50mA, SMD GULL WING Source: Datasheet <https://componentsearchengine.com/Datasheets/1/TL3301AF260QG.pdf>; DESCRIPTION: E-SWITCH - TL3301AF260QG - SWITCH, TACTILE SPST 50mA, SMD GULL WING; HEIGHT: 7mm; MANUFACTURER_NAME: E-Switch; MANUFACTURER_PART_NUMBER: TL3301AF260QG; MOUSER_PART_NUMBER: 612-TL3301AF2; MOUSER_PRICE-STOCK: https://www.mouser.com/Search/Refine.aspx?Keyword=612-TL3301AF2
TP1-TP4 TP6-TP10 TP12-TP15 = testpad:TP: Test pad
U1 = MIMXRT1052DVL6A:MIMXRT1052DVL6A: MIMXRT1052: 3.3 V 600 MHz ARM® Cortex®-M7 Microprocessor IC; DESCRIPTION: MIMXRT1052: 3.3 V 600 MHz ARM® Cortex®-M7 Microprocessor IC; DIGI-KEY_PART_NUMBER: 568-13515-ND; DIGI-KEY_PURCHASE_URL: https://www.digikey.com/product-detail/en/nxp-usa-inc/MIMXRT1052DVL6A/568-13515-ND/7646297?utm_source=snapeda&utm_medium=aggregator&utm_campaign=symbol; MF: NXP USA; MP: MIMXRT1052DVL6A; PACKAGE: LFBGA-196 NXP Semiconductors
U2 = MCP1702T1802ECB:MCP1702T-1802E/CB; BUILT_BY: EMA_Jessica; COPYRIGHT: Copyright (C) 2018 Accelerated Designs. All rights reserved; MANUFACTURER_PART_NUMBER: MCP1702T-1802E/CB; VENDOR: Microchip
U3 U7 U9 = NXP - FXAS21002CQR1:NXP_FXAS21002CQR1: Gyroscope Triple 3.6V 24-Pin QFN T/R; CENTROID_NOT_SPECIFIED: No; DATASHEET: https://www.nxp.com/docs/en/data-sheet/FXAS21002.pdf; DEVICE_CLASS_L1: Sensors; DEVICE_CLASS_L2: Motion Sensors; DEVICE_CLASS_L3: Gyroscopes; DIGIKEY_DESCRIPTION: IC GYROSCOPE 3-AXIS 24QFN; DIGIKEY_PART_NUMBER: FXAS21002CQR1CT-ND; FOOTPRINT_URL: https://www.nxp.com/docs/en/package-information/98ASA00356D.pdf; HEIGHT: 1.1mm; LEAD_FREE: yes; MAX_SUPPLY_VOLTAGE: 3.6V; MF: NXP; MFG_PACKAGE_IDENT: SOT1681-1; MFG_PACKAGE_IDENT_DATE: 01/2016; MFG_PACKAGE_IDENT_REV: A; MIN_SUPPLY_VOLTAGE: 1.95V; MOUSER_DESCRIPTION: Gyroscopes Triple Axis }2000?/s 24-Pin QFN Tape and Reel; MOUSER_PART_NUMBER: 841-FXAS21002CQR1; MPN: FXAS21002CQR1; OPERATING_SUPPLY_CURRENT: 2.7mA; PACKAGE: VQFN24; PREFIX: U; ROHS: yes; SENSOR_OUTPUT: I2C,SPI; TEMPERATURE_RANGE_HIGH: +85°C; TEMPERATURE_RANGE_LOW: -40°C; VERIFICATION_VERSION: 0.0.0.1
U4 = MK20DX128VFM5:MK20DX128VFM5: Kinetis K20: 50MHz Cortex-M4 Performance MCU, 160KB Flash, 16KB SRAM, Full-Speed USB, 32-QFN; DESCRIPTION: MCU 32-bit Kinetis K20 ARM Cortex M4 RISC 128KB Flash 1.8V/2.5V/3.3V 32-Pin QFN EP Tray; DIGI-KEY_PART_NUMBER: MK20DX128VFM5-ND; DIGI-KEY_PURCHASE_URL: https://www.digikey.com/product-detail/en/nxp-usa-inc/MK20DX128VFM5/MK20DX128VFM5-ND/3507507?utm_source=snapeda&utm_medium=aggregator&utm_campaign=symbol; MF: MikroElektronika; MP: MK20DX128VFM5; PACKAGE: QFN-32 Freescale Semiconductor
U5 = NLX2G14CMUTCG:NLX2G14CMUTCG; BUILT_BY: EMA_Jessica; COPYRIGHT: Copyright (C) 2016 Accelerated Designs. All rights reserved; MANUFACTURER_PART_NUMBER: NLX2G14CMUTCG; VENDOR: ON Semiconductor
U6 = NTSX2102GU8H:NTSX2102GU8H: NTSX2102 - Dual supply translating transceiver; open drain; auto direction sensing; DESCRIPTION: NTSX2102 - Dual supply translating transceiver; open drain; auto direction sensing; DIGI-KEY_PART_NUMBER: 568-10216-1-ND; DIGI-KEY_PURCHASE_URL: https://www.digikey.com/product-detail/en/nxp-usa-inc/NTSX2102GU8H/568-10216-1-ND/3991872?utm_source=snapeda&utm_medium=aggregator&utm_campaign=symbol; MF: NXP USA; MP: NTSX2102GU8H; PACKAGE: XQFN-8 NXP Semiconductors
U8 = NX5P3090UKZ:NX5P3090UKZ: USB Power SW Single 2.5V to 5.5V 0.4A to 3.3A 12-Pin WLCSP; DESCRIPTION: USB Power SW Single 2.5V to 5.5V 0.4A to 3.3A 12-Pin WLCSP; DIGI-KEY_PART_NUMBER: 568-13049-1-ND; DIGI-KEY_PURCHASE_URL: https://www.digikey.com/product-detail/en/nxp-usa-inc/NX5P3090UKZ/568-13049-1-ND/6173637?utm_source=snapeda&utm_medium=aggregator&utm_campaign=symbol; MF: NXP USA; MP: NX5P3090UKZ; PACKAGE: UFBGA-12 NXP Semiconductors
U10-U12 = Honeywell - HMC5983-TR:HONEYWELL_HMC5983-TR: 3-Axis Digital Compass IC; CENTROID_NOT_SPECIFIED: No; DATASHEET: https://aerocontent.honeywell.com/aero/common/documents/myaerospacecatalog-documents/Defense_Brochures-documents/HMC5983_3_Axis_Compass_IC.pdf; DIGIKEY_DESCRIPTION: IC Magnetoresistive Sensor X, Y, Z Axis 16-LPCC (3x3); DIGIKEY_PART_NUMBER: 342-1092-1-ND; LEAD_FREE: yes; MF: Honeywell; MPN: HMC5983-TR; PACKAGE: LPCC16; PREFIX: U; ROHS: yes; TEMPERATURE_RANGE_HIGH: +85°C; TEMPERATURE_RANGE_LOW: -30°C